# EAGLE design rtu01n02 (EAGLE 9.6.0)
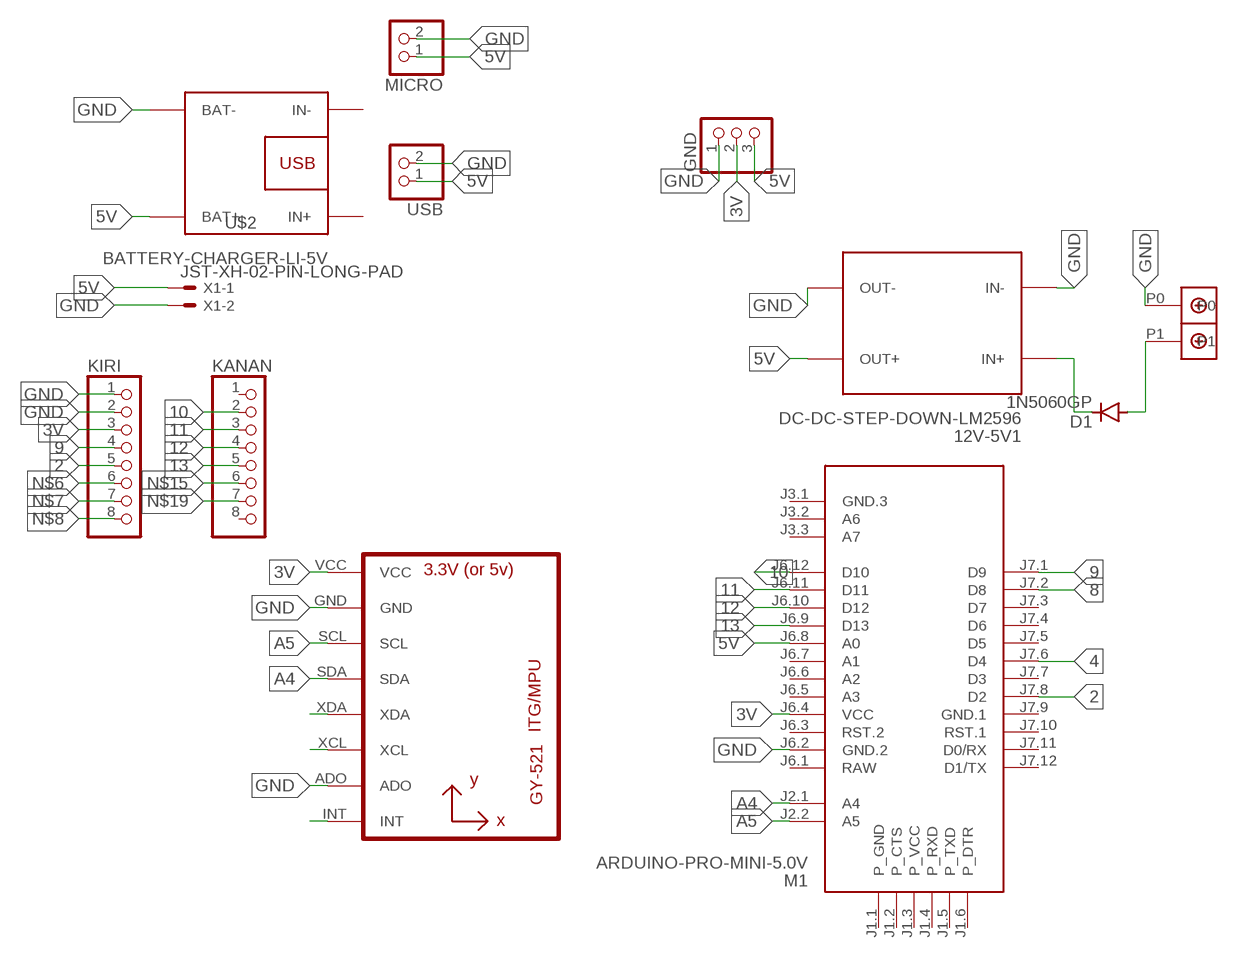
[diagram p0: schematic, sheet 1]

## Parts
12V-5V1  DC-DC-STEP-DOWN-LM2596  [DC-DC-STEP-DOWN-LM2596]
D1  1N5060GP  [DO15-12]
GND  PINHD-1X3  [1X03]
KANAN  PINHD-1X8  [1X08]
KIRI  PINHD-1X8  [1X08]
M1  ARDUINO-PRO-MINI-5.0V  [ARDUINO-PRO-MINI]
MICRO  PINHD-1X2  [1X02]
U1  GY-521MPU6050  [GY-521]
U$1  DBCONN-1X2  [DBCONN-1X2]
U$2  BATTERY-CHARGER-LI-5V  [BATTERY-CHARGER-LI-5V]
USB  PINHD-1X2  [1X02]
X1  JST-XH-02-PIN-LONG-PAD  [JST-XH-02-PACKAGE-LONG-PAD]

## Nets
2: KIRI.5 M1.J7.8(D2)
3V: GND.2 KIRI.3 M1.J6.4(VCC) U1.VCC
4: M1.J7.6(D4)
5V: 12V-5V1.OUT+ GND.3 M1.J6.8(A0) MICRO.1 U$2.BAT+ USB.1 X1.1
8: M1.J7.2(D8)
9: KIRI.4 M1.J7.1(D9)
10: KANAN.2 M1.J6.12(D10)
11: KANAN.3 M1.J6.11(D11)
12: KANAN.4 M1.J6.10(D12)
13: KANAN.5 M1.J6.9(D13)
A4: M1.J2.1(A4) U1.SDA
A5: M1.J2.2(A5) U1.SCL
GND: 12V-5V1.IN- 12V-5V1.OUT- GND.1 KIRI.1 KIRI.2 M1.J6.2(GND.2) MICRO.2 U1.ADO U1.GND U$1.P0 U$2.BAT- USB.2 X1.2
N$1: D1.A U$1.P1
N$2: 12V-5V1.IN+ D1.C
N$6: KIRI.6
N$7: KIRI.7
N$8: KIRI.8
N$15: KANAN.6
N$16: U1.XCL
N$18: U1.INT
N$19: KANAN.7
SCL: U1.XDA
Unconnected: KANAN.1 KANAN.8 M1.J1.1(P_GND) M1.J1.2(P_CTS) M1.J1.3(P_VCC) M1.J1.4(P_RXD) M1.J1.5(P_TXD) M1.J1.6(P_DTR) M1.J3.1(GND.3) M1.J3.2(A6) M1.J3.3(A7) M1.J6.3(RST.2) M1.J6.5(A3) M1.J6.6(A2) M1.J6.7(A1) M1.J7.3(D7) M1.J7.4(D6) M1.J7.5(D5) M1.J7.7(D3) M1.J7.10(RST.1) M1.J7.11(D0/RX) M1.J7.12(D1/TX) U$2.IN+ U$2.IN-

## Power pins joined to a net without a drawn wire
GND.1: M1.J7.9(GND.1)
RAW: M1.J6.1(RAW)

## Library data of the parts
12V-5V1 = diy-modules:DC-DC-STEP-DOWN-LM2596: DC/DC Step-Down Regulator based on LM2596-ADJ chip LM2596 datasheet available here: http://www.ti.com/lit/ds/symlink/lm2596.pdf Click here to find device on ebay.com <http://www.ebay.com/sch/lm2596+power+regulator>
D1 = diode:1N5060GP: DIODE controlled avalanche rectifier
GND = pinhead:PINHD-1X3: PIN HEADER
KANAN KIRI = pinhead:PINHD-1X8: PIN HEADER
M1 = diy-modules:ARDUINO-PRO-MINI-*: Arduino Pro Mini and compatible devices More details available here: https://www.arduino.cc/en/Main/ArduinoBoardProMini Click here to find device on ebay.com <http://www.ebay.com/sch/arduino+pro+mini>
MICRO USB = pinhead:PINHD-1X2: PIN HEADER
U1 = gy-521:GY-521
U$1 = Terminal Block Connector:DBCONN-1X2
U$2 = diy-modules (1):BATTERY-CHARGER-LI-5V: Lithium Battery 5V Charger More details available here: http://www.buildcircuit.com/how-to-use-micro-usb-5v-1a-lithium-battery-charging-board-charger-module/ Click here to find device on ebay.com <http://www.ebay.com/sch/tp4056+charger+usb>
X1 = Rembrandt Electronics - JST XH Connectors v1-0:JST-XH-02-PIN: JST XH Connector 2 Pin Wire to board connector. Pitch: 2,54 mm, (0.100") Number of pins: 2 Created by Rembrandt Electronics www.rembrandtelectronics.com

## Board
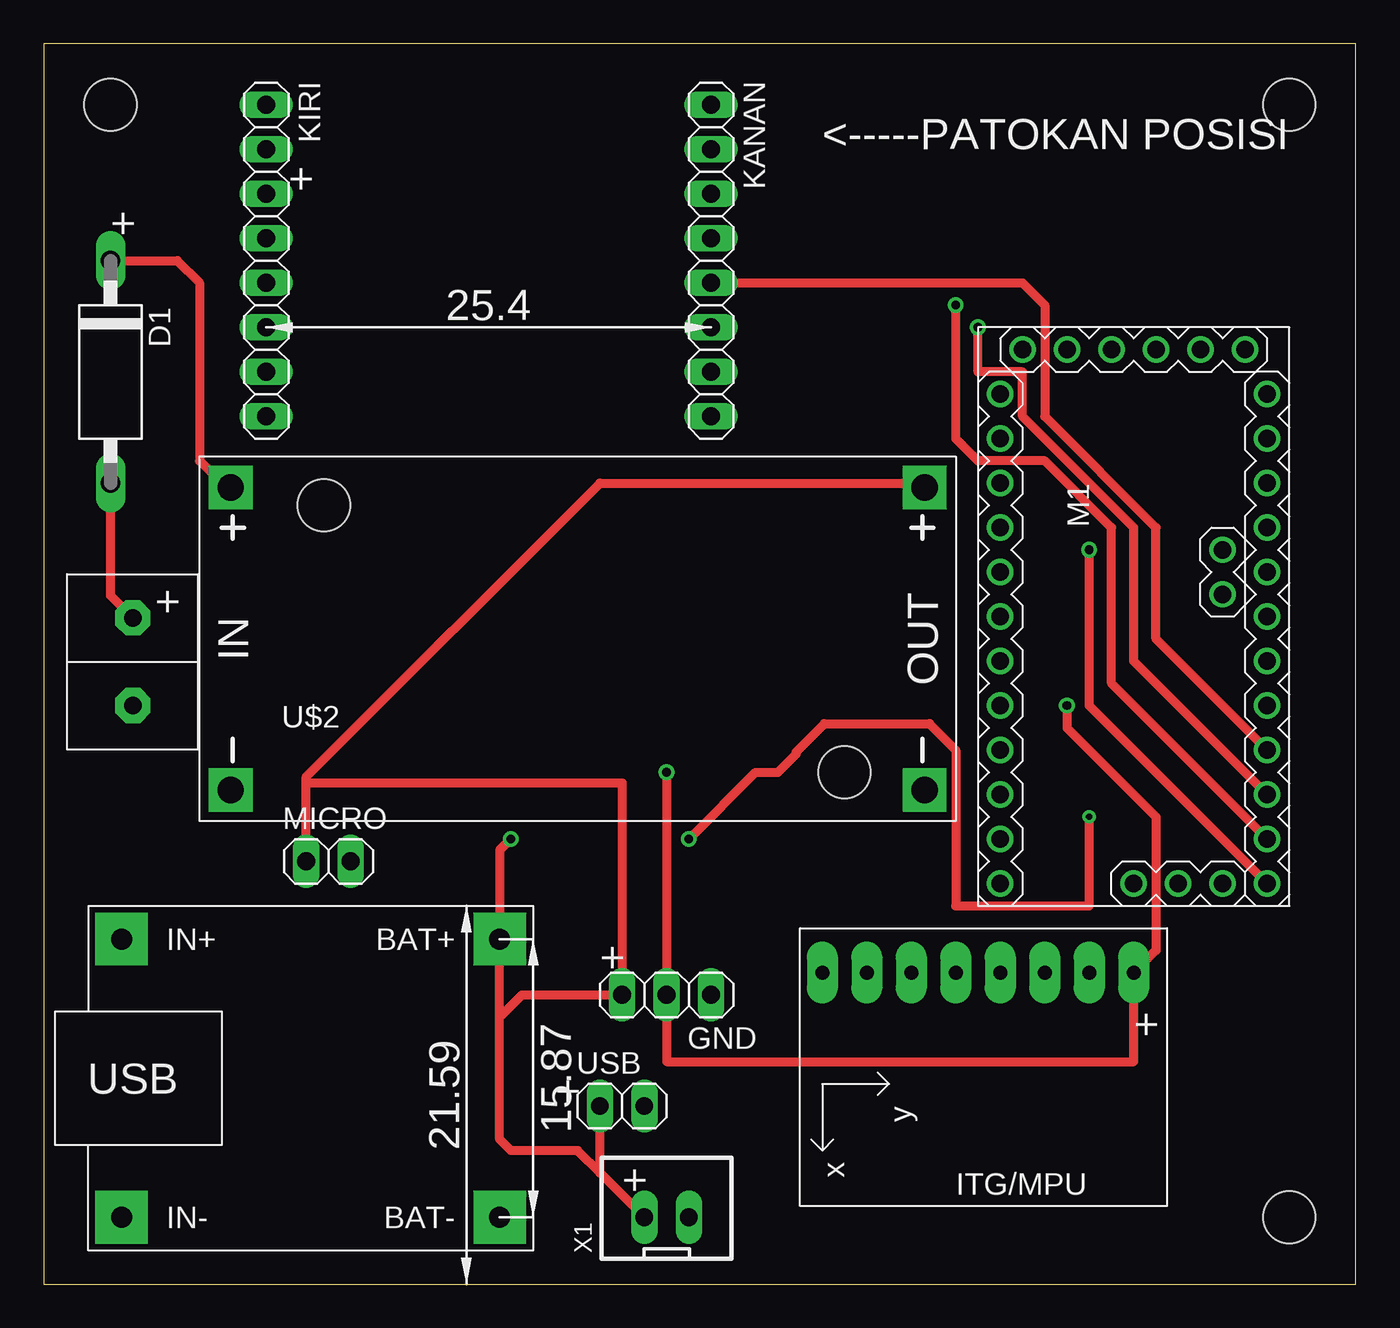
[diagram p1: board, top side]
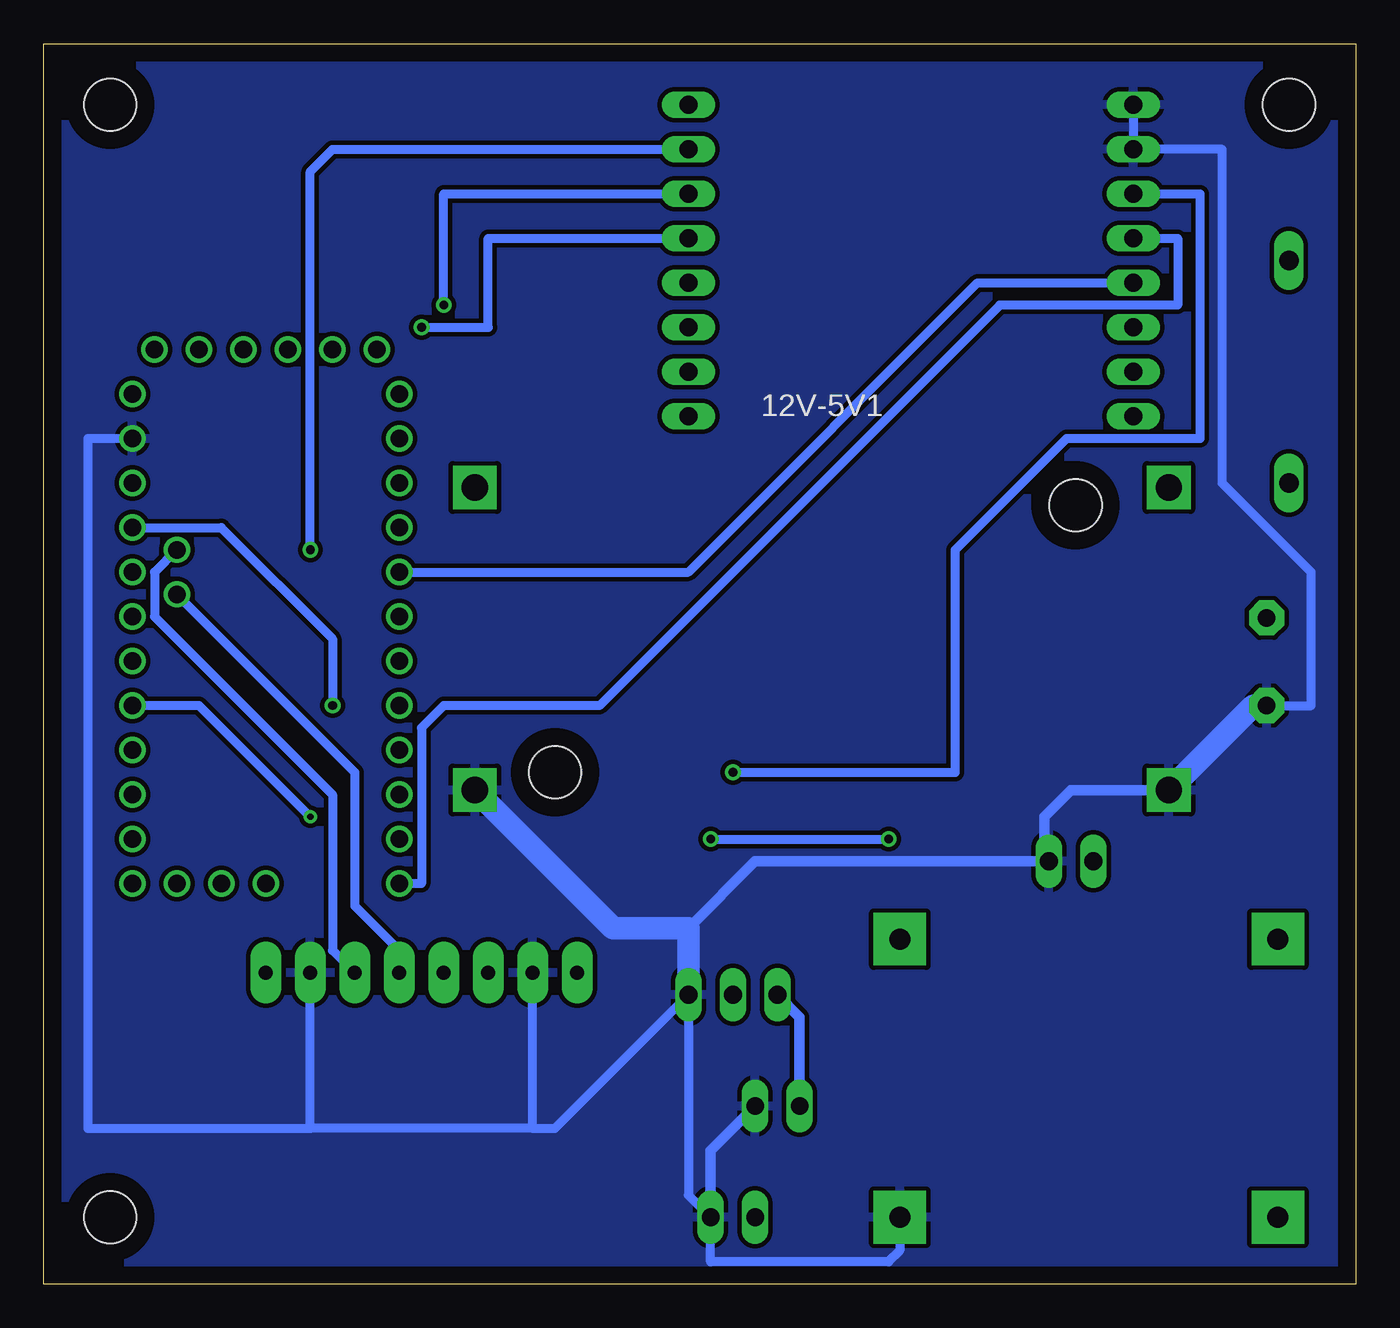
[diagram p2: board, bottom side, seen from below]

Size 74.91 x 70.79 mm. Coordinates in mm from the lower left corner, seen from the top.
Outline: 0,0 74.91,0 74.91,70.79 0,70.79 0,0
Copper layers (1*16): Top 0.035mm / dielectric 1.5mm / Bottom 0.035mm
Design rules "default": minimum track width 6mil, minimum drill 0.35mm, track to track 6mil, track to pad 6mil, pad to pad 6mil, via to via 6mil, smd to smd 6mil, copper to edge 40mil, drill to drill 6mil, minimum pad ring 10mil, minimum via ring 8mil, stop-mask expansion 4mil, vias tented up to drill 0mil, thermal gap 10mil
Holes 3 mm at 3.81,67.31 71.12,3.81 71.12,67.31

### Footprints (pad centres in the part's own frame; a part is rotated, then mirrored left to right if it is on the bottom)
DC-DC-STEP-DOWN-LM2596 = drill 1.5 pad 2.5 square: IN+ -19.812,8.636; IN- -19.812,-8.636; OUT+ 19.812,8.636; OUT- 19.812,-8.636 | hole 3: -14.478,7.62; 15.24,-7.62
DO15-12 = drill 1.118 long: A 6.35,0; C -6.35,0
1X03 = drill 1.016 long: 1 -2.54,0; 2 0,0; 3 2.54,0
1X08 = drill 1.016 long: 1 -8.89,0; 2 -6.35,0; 3 -3.81,0; 4 -1.27,0; 5 1.27,0; 6 3.81,0; 7 6.35,0; 8 8.89,0
ARDUINO-PRO-MINI = drill 1: J1.1 -15.24,6.35; J1.2 -15.24,3.81; J1.3 -15.24,1.27; J1.4 -15.24,-1.27; J1.5 -15.24,-3.81; J1.6 -15.24,-6.35; J2.1 -1.27,5.08; J2.2 -3.81,5.08; J3.1 15.24,0; J3.2 15.24,2.54; J3.3 15.24,5.08; J6.1 -12.7,7.62; J6.2 -10.16,7.62; J6.3 -7.62,7.62; J6.4 -5.08,7.62; J6.5 -2.54,7.62; J6.6 0,7.62; J6.7 2.54,7.62; J6.8 5.08,7.62; J6.9 7.62,7.62; J6.10 10.16,7.62; J6.11 12.7,7.62; J6.12 15.24,7.62; J7.1 15.24,-7.62; J7.2 12.7,-7.62; J7.3 10.16,-7.62; J7.4 7.62,-7.62; J7.5 5.08,-7.62; J7.6 2.54,-7.62; J7.7 0,-7.62; J7.8 -2.54,-7.62; J7.9 -5.08,-7.62; J7.10 -7.62,-7.62; J7.11 -10.16,-7.62; J7.12 -12.7,-7.62
1X02 = drill 1.016 long: 1 -1.27,0; 2 1.27,0
GY-521 = drill 0.8 pad 1.778 long: ADO -8.89,-6.35; GND -8.89,6.35; INT -8.89,-8.89; SCL -8.89,3.81; SDA -8.89,1.27; VCC -8.89,8.89; XCL -8.89,-3.81; XDA -8.89,-1.27
DBCONN-1X2 = drill 1 pad 2 octagon: P0 -2.54,0; P1 2.46,0
BATTERY-CHARGER-LI-5V = drill 1.2 pad 3 square: BAT+ 10.795,8.255; BAT- 10.795,-7.62; IN+ -10.795,8.255; IN- -10.795,-7.62
JST-XH-02-PACKAGE-LONG-PAD = drill 1.016 long: 1 -1.27,0; 2 1.27,0

### Placement (x,y rotation side)
12V-5V1  30.48,36.83 0 top
D1  3.81,52.07 270 top
GND  35.56,16.51 180 top
KANAN  38.1,58.42 270 top
KIRI  12.7,58.42 270 top
M1  62.23,38.1 270 top
MICRO  16.26,24.13 0 top
U1  53.34,8.89 270 top
U$1  5.08,35.56 90 top
U$2  15.24,11.43 0 top
USB  33.02,10.16 0 top
X1  35.56,3.81 0 top

### Tracks (layer width: path | path; a pad name or v marks a point on that pad's centre or on a via)
2
  Bottom 0.508: M1.J7.8 38.1,40.64 21.59,57.15 KIRI.5
3V  (via drill 0.5)
  Top 0.508: v35.56,29.21 GND.2 35.56,12.7 62.23,12.7 U1.VCC 63.5,19.05 63.5,26.67 58.42,31.75 v58.42,33.02
  Bottom 0.508: v35.56,29.21 22.86,29.21 22.86,41.91 16.51,48.26 8.89,48.26 8.89,62.23 KIRI.3 | M1.J6.4 64.77,43.18 58.42,36.83 v58.42,33.02
5V  (via drill 0.35, 0.5)
  Top 0.508: X1.1 31.75,6.35 | 31.75,6.35 30.48,7.62 26.67,7.62 26.04,8.26 26.04,15.24 | 12V-5V1.OUT+ 50.04,45.72 31.75,45.72 14.99,28.96 MICRO.1 14.99,28.6 33.02,28.6 GND.3 27.3,16.51 26.04,15.24 | 26.04,15.24 U$2.BAT+ 26.04,24.77 v26.67,25.4 | 31.75,6.35 USB.1 | v36.83,25.4 40.64,29.21 41.91,29.21 42.95,30.25 42.95,30.36 44.57,31.98 50.57,31.98 52.07,30.48 52.07,21.59 59.69,21.59 v59.69,26.67
  Bottom 0.508: v59.69,26.67 66.04,33.02 M1.J6.8 | v36.83,25.4 v26.67,25.4
  Bottom 0.61: USB.1 31.75,15.24 GND.3
9
  Bottom 0.508: KIRI.4 10.16,59.69 10.16,55.88 20.32,55.88 43.18,33.02 52.07,33.02 53.34,31.75 53.34,22.86 M1.J7.1
10  (via drill 0.5)
  Top 0.508: M1.J6.12 59.69,33.02 v59.69,41.91
  Bottom 0.508: v59.69,41.91 59.69,63.5 58.42,64.77 KANAN.2
11  (via drill 0.5)
  Top 0.508: M1.J6.11 60.96,34.29 60.96,43.18 57.15,46.99 53.34,46.99 52.07,48.26 v52.07,55.88
  Bottom 0.508: v52.07,55.88 52.07,62.23 KANAN.3
12  (via drill 0.5)
  Top 0.508: M1.J6.10 62.23,35.56 62.23,43.18 55.88,49.53 55.88,52.07 53.34,52.07 v53.34,54.61
  Bottom 0.508: v53.34,54.61 49.53,54.61 49.53,59.69 KANAN.4
13
  Top 0.508: M1.J6.9 63.5,36.83 63.5,43.18 57.15,49.53 57.15,55.88 55.88,57.15 KANAN.5
A4
  Bottom 0.508: M1.J2.1 57.15,29.21 57.15,25.4 57.15,21.59 54.61,19.05 U1.SDA
A5
  Bottom 0.508: M1.J2.2 68.58,40.64 68.58,38.1 58.42,27.94 58.42,19.05 U1.SCL
GND
  Bottom 0.508: 46.99,8.89 45.72,8.89 GND.1 38.1,5.08 X1.2 36.83,1.27 26.67,1.27 26.04,1.91 U$2.BAT- | 46.99,8.89 U1.ADO | 46.99,8.89 59.69,8.89 | 59.69,8.89 U1.GND | M1.J6.2 72.39,48.26 72.39,8.89 59.69,8.89 | KIRI.1 KIRI.2 7.62,64.77 7.62,45.72 2.54,40.64 2.54,33.02 U$1.P0
  Bottom 0.61: USB.2 36.83,7.62 X1.2 | 38.1,20.32 34.29,24.13 MICRO.2 17.78,24.38 17.78,26.67 16.26,28.19 12V-5V1.IN-
  Bottom 1.27: 12V-5V1.IN- 5.84,33.02 U$1.P0 | 12V-5V1.OUT- 42.42,20.32 38.1,20.32 GND.1
  pour Bottom (isolate 0.254): 0,71.12 74.93,71.12 74.93,0 0,0
N$1
  Top 0.508: U$1.P1 3.81,39.29 D1.A
N$2
  Top 0.508: D1.C 7.62,58.42 8.89,57.15 8.89,46.99 10.41,45.47 12V-5V1.IN+

### Text on the board
tPlace: <-----PATOKAN POSISI | + | + | + | + | + | + | +